# EAGLE design beetle_drv (EAGLE 9.1.2)
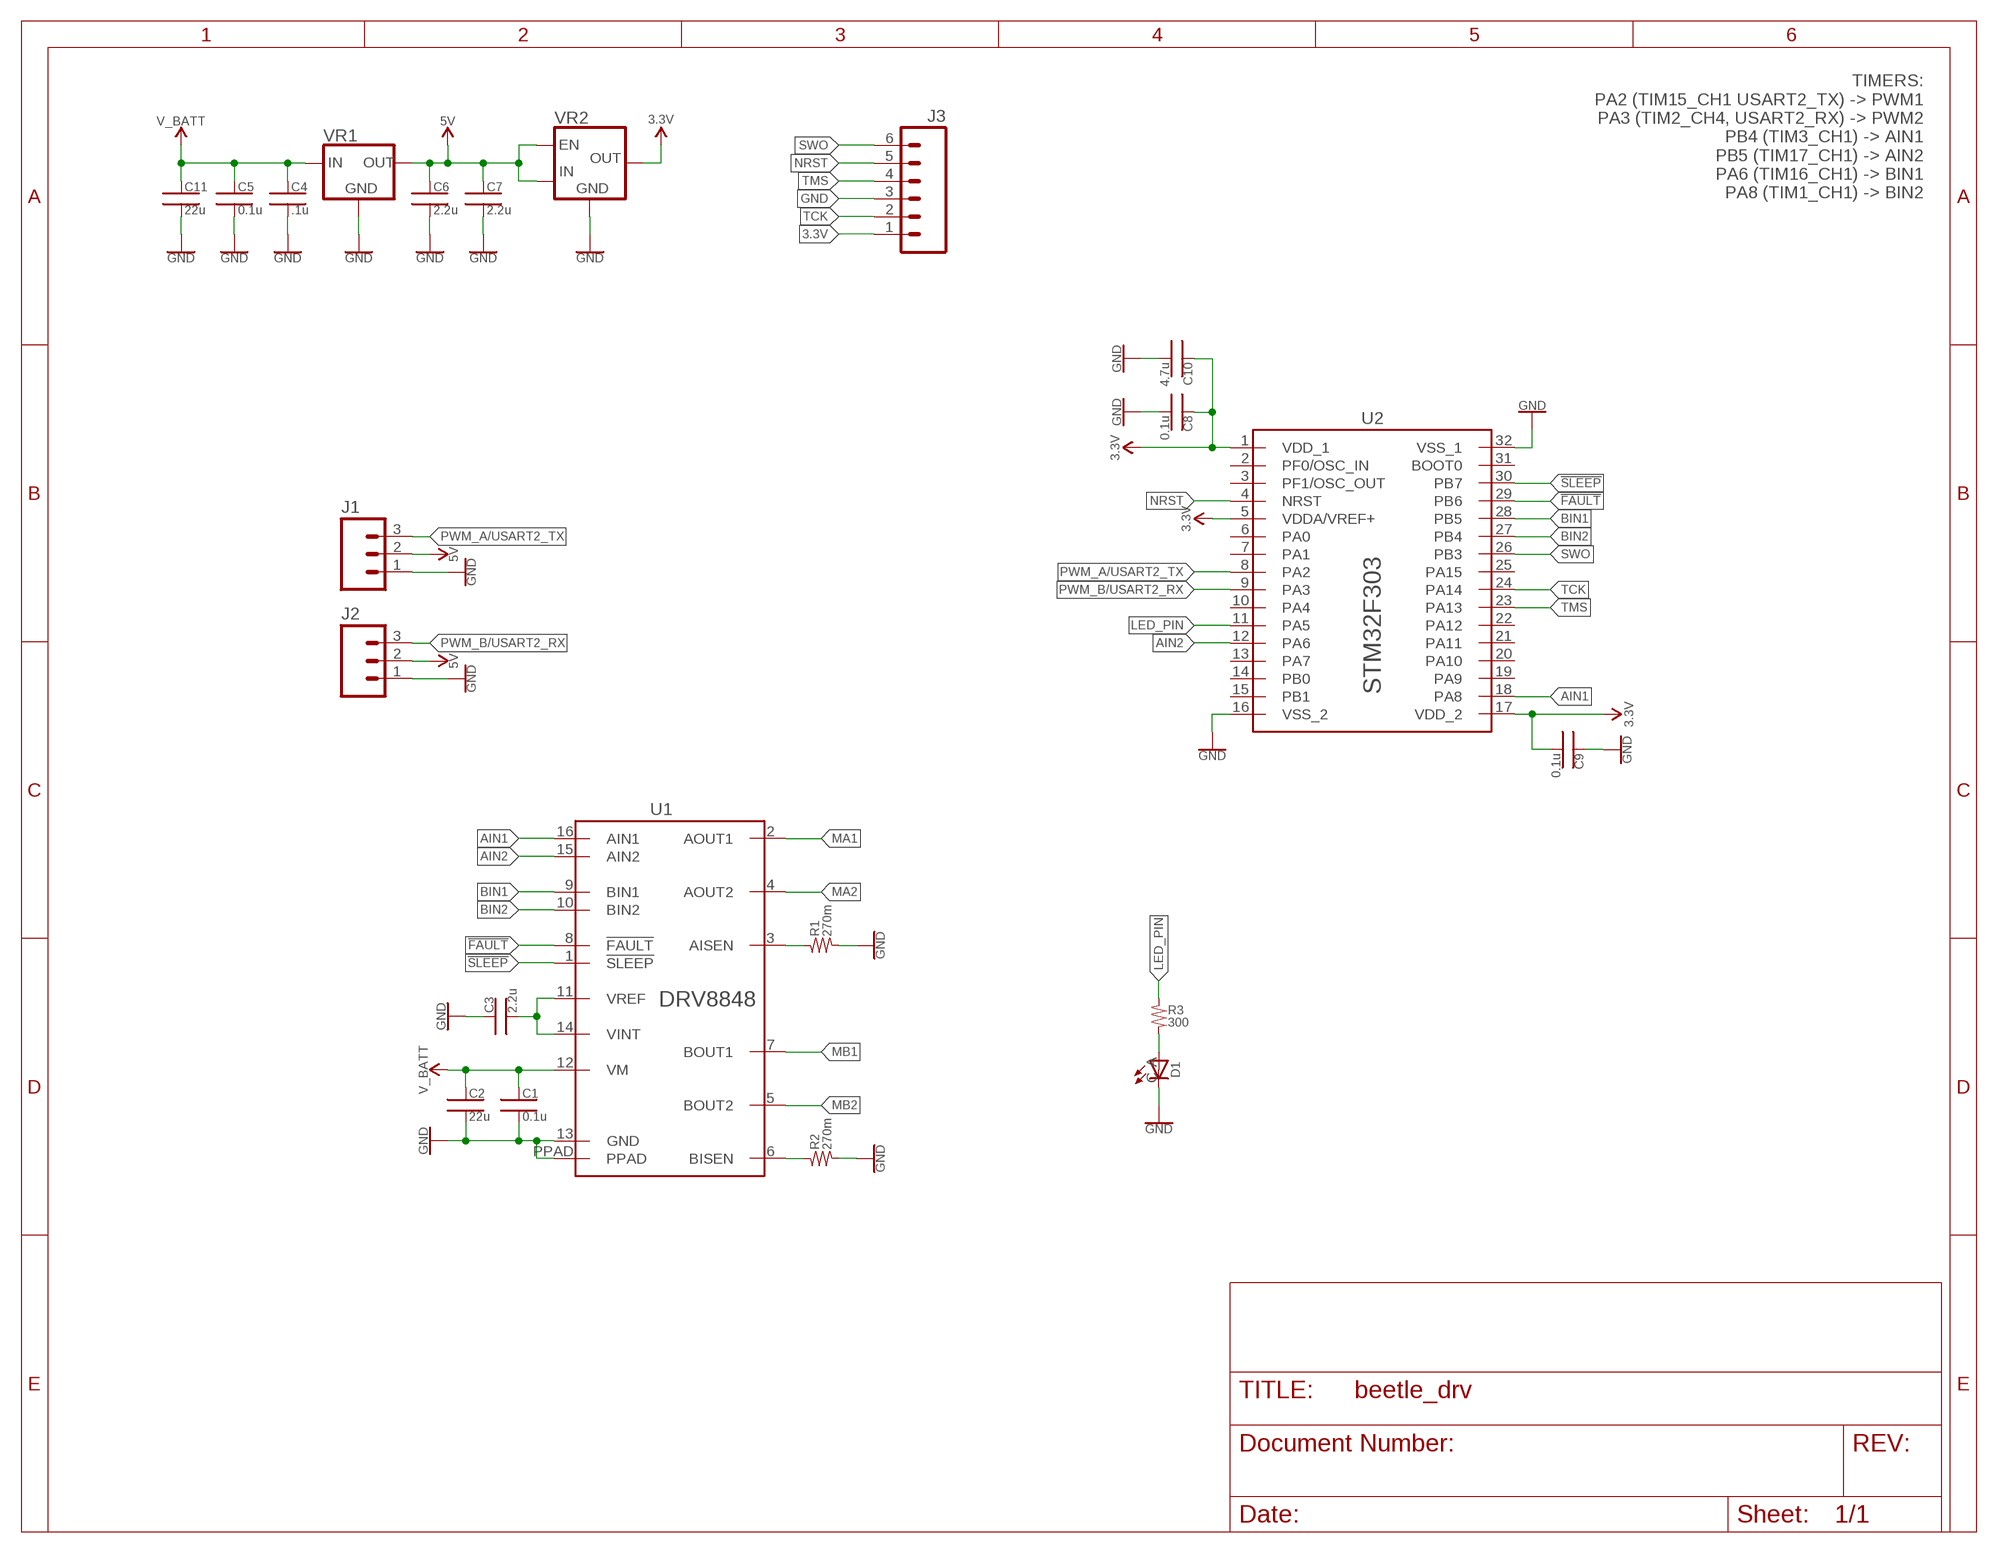
[diagram p0: schematic, sheet 1]

## Parts
C1  0.1u  CAP_SMD_0603  [0603]
C2  22u  CAP_SMD_1210  [1210]
C3  2.2u  CAP_SMD_0603  [0603]
C4  .1u  CAP_SMD_0603  [0603]
C5  0.1u  CAP_SMD_0603  [0603]
C6  2.2u  CAP_SMD_0603  [0603]
C7  2.2u  CAP_SMD_0603  [0603]
C8  0.1u  CAP_SMD_0603  [0603]
C9  0.1u  CAP_SMD_0603  [0603]
C10  4.7u  CAP_SMD_0603  [0603]
C11  22u  CAP_SMD_1210  [1210]
D1  LED1206  [LED-1206]
J1  M03  [1X03]
J2  M03  [1X03]
J3  SM06B-SRSS-TB  [SM06B-SRSS-TB]
R1  270m  RES_SMD_1210  [1210]
R2  270m  RES_SMD_1210  [1210]
R3  300  RES_SMD_0603  [0603]
U1  DRV8848  [PWP0016C]
U2  STM32F303_LQFP32  [LQFP32]
VR1  78XX_VREG_SOT223  [SOT223-4]
VR2  TLV733P_SOT23  [SOT23-5]

## Nets
3.3V: C8.1 C9.2 C10.1 J3.1 U2.1(VDD_1) U2.5(VDDA/VREF+) U2.17(VDD_2) VR2.5(OUT)
5V: C6.1 C7.1 J1.2 J2.2 VR1.3(OUT) VR2.1(IN) VR2.3(EN)
!FAULT: U1.8(!FAULT) U2.29(PB6)
!SLEEP: U1.1(!SLEEP) U2.30(PB7)
AI_SEN: R1.1 U1.3(AISEN)
AIN1: U1.16(AIN1) U2.18(PA8)
AIN2: U1.15(AIN2) U2.12(PA6)
BIN1: U1.9(BIN1) U2.28(PB5)
BIN2: U1.10(BIN2) U2.27(PB4)
BISEN: R2.1 U1.6(BISEN)
GND: C1.2 C2.2 C3.1 C4.2 C5.2 C6.2 C7.2 C8.2 C9.1 C10.2 C11.2 D1.C J1.1 J2.1 J3.3 R1.2 R2.2 U1.13(GND) U1.PPAD U2.16(VSS_2) U2.32(VSS_1) VR1.2(GND) VR1.4(GND) VR2.2(GND) VR2.4(GND)
LED_PIN: R3.1 U2.11(PA5)
MA1: U1.2(AOUT1)
MA2: U1.4(AOUT2)
MB1: U1.7(BOUT1)
MB2: U1.5(BOUT2)
N$7: D1.A R3.2
NRST: J3.5 U2.4(NRST)
PWM_A/USART2_TX: J1.3 U2.8(PA2)
PWM_B/USART2_RX: J2.3 U2.9(PA3)
SWO: J3.6 U2.26(PB3)
TCK: J3.2 U2.24(PA14)
TMS: J3.4 U2.23(PA13)
V_BATT: C1.1 C2.1 C4.1 C5.1 C11.1 U1.12(VM) VR1.1(IN)
VINT: C3.2 U1.11(VREF) U1.14(VINT)
Unconnected: U2.2(PF0/OSC_IN) U2.3(PF1/OSC_OUT) U2.6(PA0) U2.7(PA1) U2.10(PA4) U2.13(PA7) U2.14(PB0) U2.15(PB1) U2.19(PA9) U2.20(PA10) U2.21(PA11) U2.22(PA12) U2.25(PA15) U2.31(BOOT0)

## Notes on the sheet
- TIMERS:
  PA2 (TIM15_CH1 USART2_TX) -> PWM1
  PA3 (TIM2_CH4, USART2_RX) -> PWM2
  PB4 (TIM3_CH1) -> AIN1
  PB5 (TIM17_CH1) -> AIN2
  PA6 (TIM16_CH1) -> BIN1
  PA8 (TIM1_CH1) -> BIN2

## Library data of the parts
C1-C11 = beetle_drv:CAP_SMD
D1 = beetle_drv:LED
J1 J2 = beetle_drv:M03
J3 = beetle_drv:?M06B-SRSS-TB: Disconnectable Crimp style connector, 1.0mm pitch 6 contacts
R1-R3 = beetle_drv:RES_SMD
U1 = beetle_drv:DRV8848: Dual H-Bridge Motor Driver, 2x2Amps, 4-18v
U2 = beetle_drv:STM32F303_LQFP32: STM32F303 LQFP32 edition according to https://www.st.com/content/ccc/resource/technical/document/datasheet/group3/38/c6/ca/d1/f7/d5/4e/30/DM00092070/files/DM00092070.pdf/jcr:content/translations/en.DM00092070.pdf
VR1 = beetle_drv:78XX_VREG: Generic IGO 78XX linear voltage regulator
VR2 = beetle_drv:TLV733P: Cap-Free 300ma 5v to 3.3v linear regulator

## Board
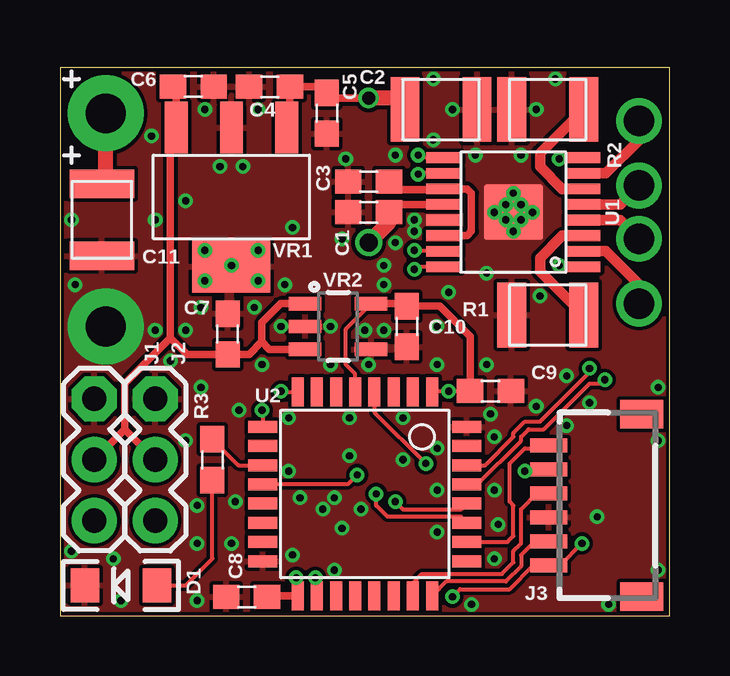
[diagram p1: board, top side]
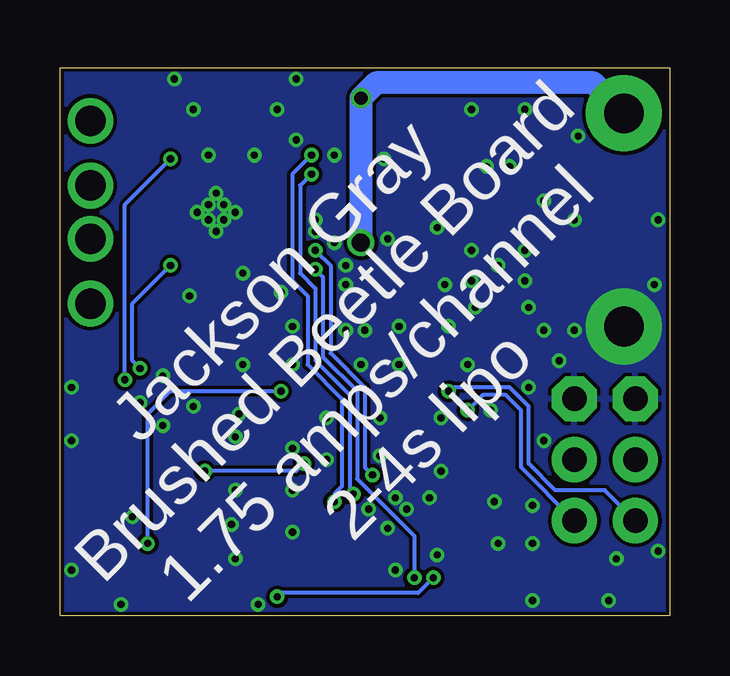
[diagram p2: board, bottom side, seen from below]

Size 25.4 x 22.86 mm. Coordinates in mm from the lower left corner, seen from the top.
Outline: 0,0 25.4,0 25.4,22.86 0,22.86 0,0
Copper layers (1*16): Top 0.035mm / dielectric 1.5mm / Bottom 0.035mm
Design rules "3PCB_2layer": minimum track width 6mil, minimum drill 0.3mm, track to track 6mil, track to pad 6mil, pad to pad 6mil, via to via 6mil, smd to smd 0mil, copper to edge 6mil, drill to drill 6mil, minimum pad ring 6mil, minimum via ring 6mil, stop-mask expansion 2mil, vias tented up to drill 0.3mm, thermal gap 6.25mil

### Footprints (pad centres in the part's own frame; a part is rotated, then mirrored left to right if it is on the bottom)
0603 = smd 1.1 x 1: 1 -0.85,0; 2 0.85,0
1210 = smd 1.2 x 2.7: 1 -1.5,0; 2 1.5,0
LED-1206 = smd 1.2 x 1.4: A -1.5,0; C 1.5,0
1X03 = drill 1.016 pad 1.88 octagon: 1 0,0 | drill 1.016 pad 1.88: 2 2.54,0; 3 5.08,0
SM06B-SRSS-TB = smd 0.6 x 1.55: 1 -2.5,2.975; 2 -1.5,2.975; 3 -0.5,2.975; 4 0.5,2.975; 5 1.5,2.975; 6 2.5,2.975 | smd 1.2 x 1.8: FIT@1 -3.8,-0.9; FIT@2 3.8,-0.9
PWP0016C = smd 1.5 x 0.45: 1 -2.9,2.275; 2 -2.9,1.625; 3 -2.9,0.975; 4 -2.9,0.325; 5 -2.9,-0.325; 6 -2.9,-0.975; 7 -2.9,-1.625; 8 -2.9,-2.275; 9 2.9,-2.275; 10 2.9,-1.625; 11 2.9,-0.975; 12 2.9,-0.325; 13 2.9,0.325; 14 2.9,0.975; 15 2.9,1.625; 16 2.9,2.275 | smd 2.46 x 2.31: PPAD 0,0
LQFP32 = smd 0.5 x 1.2: 1 -2.8,-4.25; 2 -2,-4.25; 3 -1.2,-4.25; 4 -0.4,-4.25; 5 0.4,-4.25; 6 1.2,-4.25; 7 2,-4.25; 8 2.8,-4.25; 17 2.8,4.25; 18 2,4.25; 19 1.2,4.25; 20 0.4,4.25; 21 -0.4,4.25; 22 -1.2,4.25; 23 -2,4.25; 24 -2.8,4.25 | smd 1.2 x 0.5: 9 4.25,-2.8; 10 4.25,-2; 11 4.25,-1.2; 12 4.25,-0.4; 13 4.25,0.4; 14 4.25,1.2; 15 4.25,2; 16 4.25,2.8; 25 -4.25,2.8; 26 -4.25,2; 27 -4.25,1.2; 28 -4.25,0.4; 29 -4.25,-0.4; 30 -4.25,-1.2; 31 -4.25,-2; 32 -4.25,-2.8
SOT223-4 = smd 0.95 x 2.15: 1 -2.3,-2.9; 2 0,-2.9; 3 2.3,-2.9 | smd 3.25 x 2.15: 4 0,2.9
SOT23-5 = smd 0.55 x 1.35: 1 -0.95,-1.375; 2 0,-1.375; 3 0.95,-1.375; 4 0.95,1.375; 5 -0.95,1.375

### Placement (x,y rotation side)
C1  12.86,16.83 180 top
C2  15.88,21.11 0 top
C3  12.86,18.1 0 top
C4  8.73,22.07 180 top
C5  11.11,20.95 270 top
C6  5.56,22.07 0 top
C7  6.99,11.75 90 top
C8  7.78,0.79 180 top
C9  17.94,9.37 180 top
C10  14.45,12.06 270 top
C11  1.75,16.51 270 top
D1  2.54,1.27 180 top
J1  1.43,9.05 270 top
J2  3.97,9.05 270 top
J3  23.34,4.6 90 top
R1  20.32,12.54 180 top
R2  20.32,21.11 180 top
R3  6.35,6.51 270 top
U1  18.89,16.83 180 top
U2  12.7,5.08 180 top
VR1  7.14,17.46 180 top
VR2  11.59,12.06 270 top

### Tracks (layer width: path | path; a pad name or v marks a point on that pad's centre or on a via)
3.3V  (via drill 0.3)
  Top 0.159: U2.17 9.9,1.53 v9.84,1.59 | v16.35,0.79 16.67,1.11 18.73,1.11 19.73,2.1 J3.1 20.84,2.1 v21.75,3.02 | C9.2 v16.19,9.37 15.54,9.37 U2.1 | U2.5 12.3,10.08 11.91,10.48 11.91,11.96 VR2.5
  Top 0.318: C8.1 8.66,0.83 U2.17 | VR2.5 14.35,13.02 C10.1 15.82,12.91 17.09,11.64 C9.2
  Bottom 0.159: v9.84,1.59 10.48,0.95 16.19,0.95 v16.35,0.79 | v21.75,3.02 21.75,8.41 20.8,9.37 v16.19,9.37
5V
  Top 0.318: J2.2 2.7,7.78 | 2.7,7.78 2.7,9.68 | J1.2 2.7,7.78 | C6.1 4.84,21.93 VR1.3 4.6,20.12 4.6,11.59 | 2.7,9.68 | 4.6,11.59 2.7,9.68 | 4.6,11.59 5.29,10.9 C7.1 7.88,10.9 8.41,11.43 | VR2.1 9.21,13.02 8.41,12.22 8.41,11.43 | VR2.3 8.73,11.12 8.41,11.43
!FAULT  (via drill 0.3)
  Top 0.159: U1.8 20.85,19.1 v20.8,19.05 | U2.29 17.39,5.48 19.21,7.3 19.21,7.46 19.53,7.78 20.16,7.78 22.07,9.68 22.54,9.68 v22.7,9.84
  Bottom 0.159: v20.8,19.05 22.7,17.14 v22.7,9.84
!SLEEP  (via drill 0.3)
  Top 0.159: U1.1 20.85,14.55 v20.8,14.61 | U2.30 17.71,6.28 18.89,7.46 18.89,7.62 19.37,8.1 20,8.1 22.07,10.16 v22.07,10.32
  Bottom 0.159: v20.8,14.61 22.38,13.02 22.38,10.64 v22.07,10.32
AI_SEN
  Top 0.445: U1.3 20.93,15.85 20,14.92 20,14.36 R1.1
AIN1  (via drill 0.3)
  Top 0.159: U1.16 14.87,14.55 v14.76,14.45 | v10.64,1.59 10.64,0.89 U2.18
  Bottom 0.159: v14.76,14.45 14.45,14.13 14.45,10.79 13.02,9.37 13.02,5.71 10.64,3.33 v10.64,1.59
AIN2  (via drill 0.3)
  Top 0.159: U1.15 14.8,15.2 v14.76,15.24 | v12.38,5.87 11.99,5.48 U2.12
  Bottom 0.159: v14.76,15.24 14.13,14.61 14.13,10.95 12.7,9.53 12.7,6.19 v12.38,5.87
BIN1  (via drill 0.3)
  Top 0.159: U1.9 15.03,19.1 v14.92,19.21 | v13.97,4.76 14.29,4.45 16.71,4.45 U2.28
  Bottom 0.159: v14.92,19.21 15.72,18.41 15.72,13.97 15.08,13.34 15.08,10.48 13.65,9.05 13.65,5.4 13.97,5.08 v13.97,4.76
BIN2  (via drill 0.3)
  Top 0.159: U1.10 14.96,18.45 v14.92,18.41 | v13.18,5.08 13.18,4.6 13.65,4.13 16.7,4.13 U2.27
  Bottom 0.159: v14.92,18.41 15.4,17.94 15.4,14.29 14.76,13.65 14.76,10.64 13.34,9.21 13.34,5.24 v13.18,5.08
BISEN
  Top 0.445: U1.6 20.93,17.8 20,18.73 20,19.3 R2.1
GND  (via drill 0.3, 1.65 pad 3.17)
  other vias: 1.91,12.06 17.14,0.48 17.94,8.41 12.7,11.91 11.27,12.06 9.21,12.06 6.03,13.97 8.26,13.97 8.26,15.24 6.03,15.24 7.14,14.61 6.67,18.73 7.62,18.73 9.68,2.54 10.95,4.45 11.75,3.65 11.43,1.91 18.1,2.38 19.84,8.73 21.11,7.94 15.72,5.24 15.72,3.49 18.26,3.81 18.1,5.24 15.72,6.99 14.29,6.51 12.06,6.67 14.29,8.26 12.06,8.26 9.53,6.03 7.3,4.76 7.46,8.57 7.14,3.02 5.71,3.02 5.71,4.6 5.71,0.64 14.76,16.03 14.76,16.51 13.97,15.56 11.75,15.72 11.91,19.05 13.97,19.21 15.56,19.84 17.3,19.21 18.57,17.14 19.21,17.14 19.21,16.51 18.57,16.51 18.89,16.03 18.1,16.83 18.89,17.62 19.68,16.83 15.72,10.48 15.72,12.06 16.19,13.49 17.78,10.48 20,13.34 17.78,14.29 13.49,13.81 13.49,14.61 8.1,12.86 9.37,13.81 5.87,12.86 4.6,10.64 3.97,11.91 5.24,11.91 8.41,10.48 11.27,10.48 3.97,16.51 5.24,17.3 9.68,16.19 15.56,22.38 20.64,22.38 19.84,21.11 19.21,19.21 8.26,21.11 6.03,21.11 3.81,20 0.48,16.51 2.54,0.64 2.22,2.38 0.48,2.7 22.86,0.48 24.92,1.91 24.92,7.3 24.92,9.53 22.38,4.13 22.07,8.89 21.11,10 18.1,7.46 11.43,4.92 12.54,4.45 10,4.92 13.49,11.91 12.86,10.48 16.35,21.11 5.87,9.53 5.24,7.3 9.53,8.26 0.64,13.81
  pour Bottom (isolate 0.079): -1.27,-1.27 -1.27,24.13 26.67,24.13 26.67,-1.27
  pour Top (isolate 0.079): -2.54,25.4 27.94,25.4 27.94,-2.54 -2.54,-2.54
LED_PIN
  Top 0.159: R3.1 7.43,6.28 U2.11
MA1  (via drill 1.27 pad 1.52)
  Top 0.445: U1.2 22.74,15.2 24.13,13.81 v24.13,13.02
MA2  (via drill 1.27 pad 1.52)
  Top 0.445: v24.13,15.72 23.34,16.5 U1.4
MB1  (via drill 1.27 pad 1.52)
  Top 0.445: U1.7 22.74,18.45 24.13,19.84 v24.13,20.64
MB2  (via drill 1.27 pad 1.52)
  Top 0.445: U1.5 23.34,17.15 v24.13,17.94
N$7
  Top 0.159: D1.A 5.24,1.27 6.35,2.38 R3.2
NRST  (via drill 0.3)
  Top 0.159: U2.4 13.1,8.49 v15.24,6.35 | v19.37,6.03 19.44,6.1 J3.5
  Bottom 0.159: v15.24,6.35 15.56,6.03 v19.37,6.03
PWM_A/USART2_TX  (via drill 0.3)
  Top 0.159: v9.21,9.37 9.24,9.33 U2.8
  Bottom 0.159: J1.3 2.7,5.24 4.76,5.24 5.87,6.35 5.87,8.73 6.67,9.53 9.05,9.53 v9.21,9.37
PWM_B/USART2_RX  (via drill 0.3)
  Top 0.159: v8.41,8.57 8.45,8.54 U2.9
  Bottom 0.159: J2.3 6.19,6.19 6.19,8.57 6.83,9.21 7.78,9.21 v8.41,8.57
SWO
  Top 0.159: U2.26 18.64,3.08 18.89,3.33 18.89,4.6 18.73,4.76 18.73,6.35 19.37,6.99 20.24,6.99 J3.6
TCK
  Top 0.159: J3.2 19.77,3.1 19.21,2.54 19.21,2.06 18.57,1.43 16.1,1.43 U2.24
TMS
  Top 0.159: U2.23 14.7,1.36 15.08,1.75 15.88,1.75 18.41,1.75 18.89,2.22 18.89,2.7 19.21,3.02 19.21,4.45 19.87,5.1 J3.4
V_BATT  (via drill 0.55, 0.75, 1.65 pad 3.17)
  Top 0.318: VR1.1 9.58,20.5 C4.1 10.85,22.07 C5.1 11.33,21.59 v12.86,21.59 | C1.1 14.03,17.15 U1.12
  Top 0.635: C11.1 1.91,18.17 v1.91,20.95 | v12.86,15.56 13.71,16.41 C1.1 | C2.1 13.9,21.59 v12.86,21.59
  Bottom 0.953: v1.91,20.95 3.17,22.23 12.22,22.23 v12.86,21.59 v12.86,15.56
VINT
  Top 0.318: U1.14 16.96,15.85 17.14,16.03 17.14,17.62 16.96,17.8 U1.11 15.97,17.78 14.03,17.78 C3.2

### Text on the board
bPlace: Jackson Gray / Brushed Beetle Board / 1.75 amps/channel / 2-4s lipo